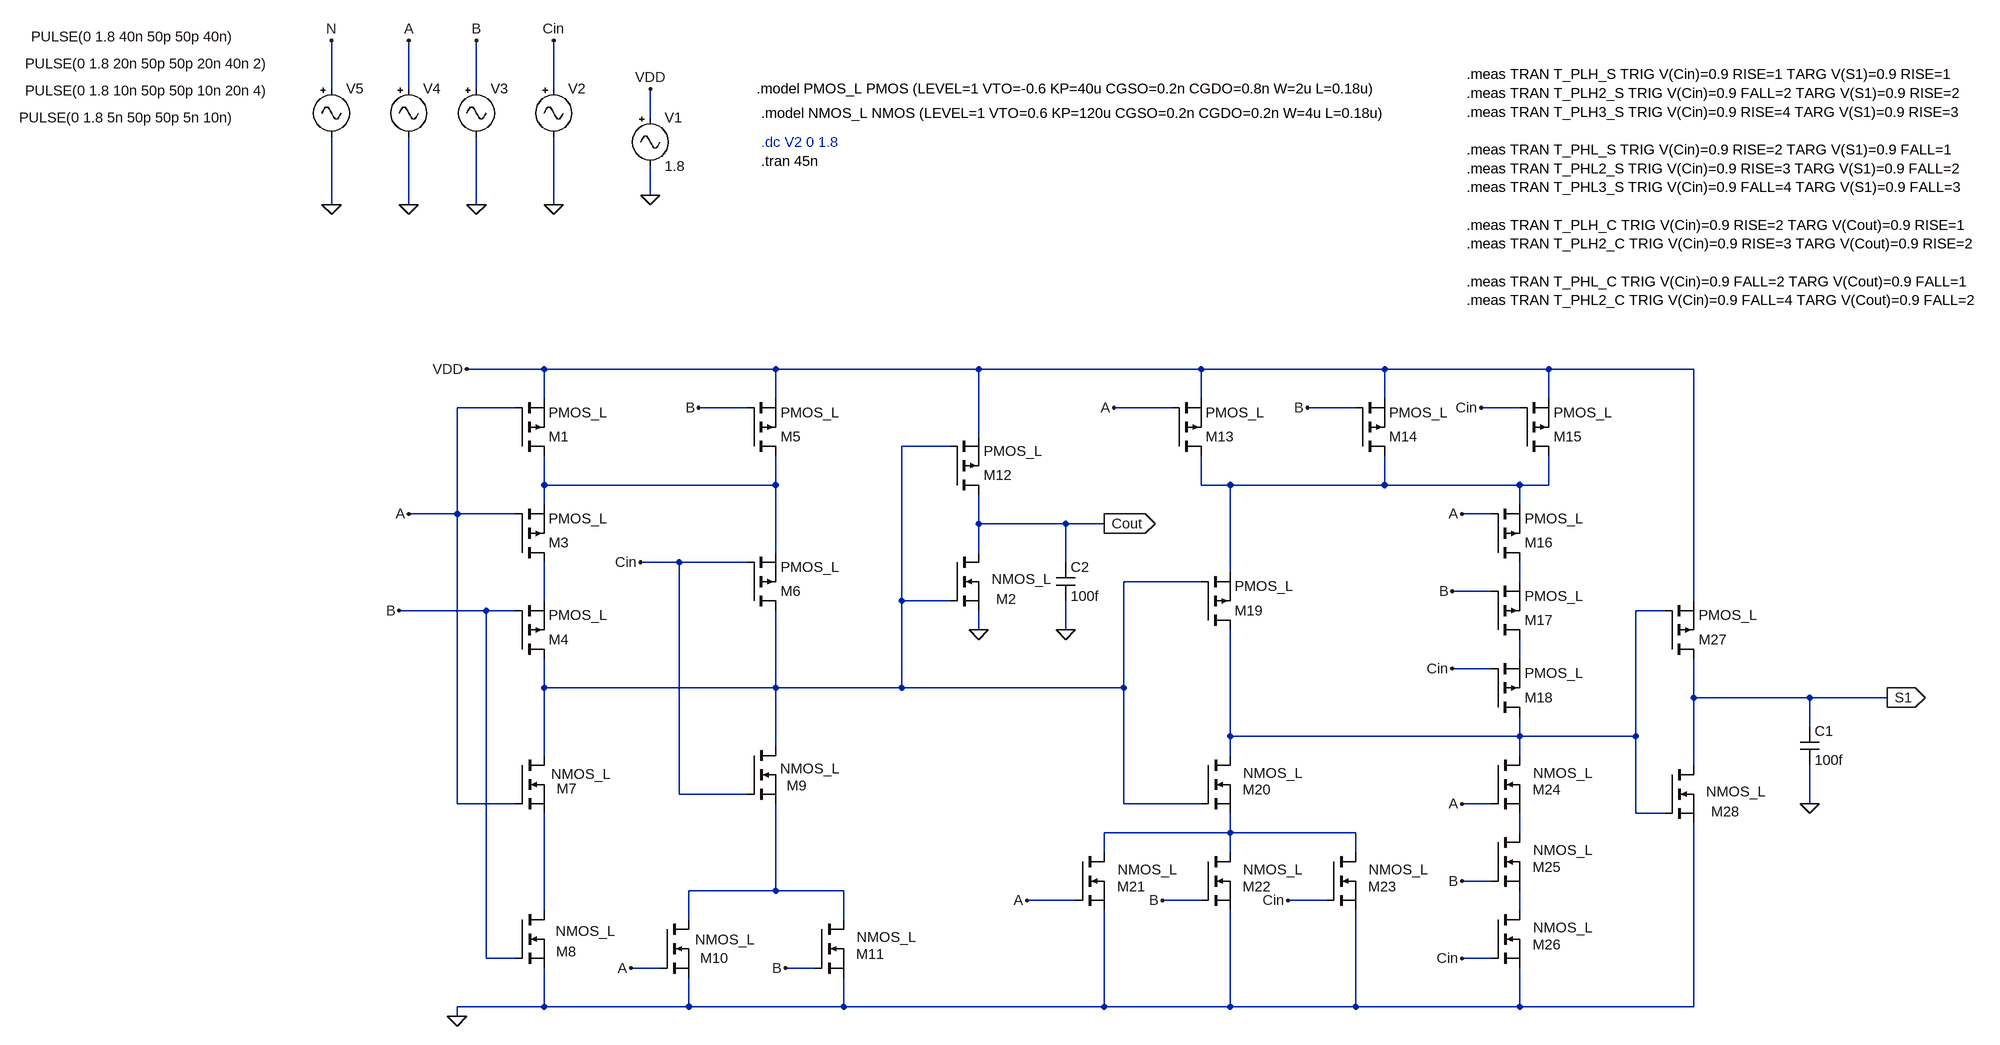
[diagram p0: schematic FullAdderT28.asc]
FullAdderT28.asc, the LTspice schematic file:
Version 4.1
SHEET 1 2296 1688
WIRE -480 80 -480 0
WIRE -352 80 -352 0
WIRE -240 80 -240 0
WIRE -112 80 -112 0
WIRE 48 128 48 80
WIRE 48 256 48 208
WIRE -480 272 -480 160
WIRE -352 272 -352 160
WIRE -240 272 -240 160
WIRE -112 272 -112 160
WIRE -128 544 -256 544
WIRE 256 544 -128 544
WIRE 592 544 256 544
WIRE 960 544 592 544
WIRE 1264 544 960 544
WIRE 1536 544 1264 544
WIRE 1776 544 1536 544
WIRE -128 592 -128 544
WIRE 256 592 256 544
WIRE 960 592 960 544
WIRE 1264 592 1264 544
WIRE 1536 592 1536 544
WIRE -176 608 -272 608
WIRE 208 608 128 608
WIRE 912 608 816 608
WIRE 1216 608 1136 608
WIRE 1488 608 1424 608
WIRE 592 656 592 544
WIRE 544 672 464 672
WIRE -128 736 -128 688
WIRE 256 736 256 688
WIRE 256 736 -128 736
WIRE 960 736 960 688
WIRE 1008 736 960 736
WIRE 1264 736 1264 688
WIRE 1264 736 1008 736
WIRE 1488 736 1264 736
WIRE 1536 736 1536 688
WIRE 1536 736 1488 736
WIRE -128 768 -128 736
WIRE 1488 768 1488 736
WIRE -272 784 -272 608
WIRE -272 784 -352 784
WIRE -176 784 -272 784
WIRE 1440 784 1392 784
WIRE 592 800 592 752
WIRE 736 800 592 800
WIRE 800 800 736 800
WIRE 256 848 256 736
WIRE 592 848 592 800
WIRE 96 864 32 864
WIRE 208 864 96 864
WIRE 736 864 736 800
WIRE 1008 880 1008 736
WIRE 960 896 832 896
WIRE 1488 896 1488 864
WIRE 1440 912 1376 912
WIRE -128 928 -128 864
WIRE 464 928 464 672
WIRE 544 928 464 928
WIRE 1776 928 1776 544
WIRE -224 944 -368 944
WIRE -176 944 -224 944
WIRE 1728 944 1680 944
WIRE 592 976 592 944
WIRE 736 976 736 928
WIRE 1488 1024 1488 992
WIRE 1440 1040 1376 1040
WIRE -128 1072 -128 1024
WIRE 256 1072 256 944
WIRE 256 1072 -128 1072
WIRE 464 1072 464 928
WIRE 464 1072 256 1072
WIRE 832 1072 832 896
WIRE 832 1072 464 1072
WIRE 1776 1088 1776 1024
WIRE 1968 1088 1776 1088
WIRE 2096 1088 1968 1088
WIRE 1968 1136 1968 1088
WIRE 1008 1152 1008 976
WIRE 1488 1152 1488 1120
WIRE 1488 1152 1008 1152
WIRE 1680 1152 1680 944
WIRE 1680 1152 1488 1152
WIRE 256 1168 256 1072
WIRE -128 1184 -128 1072
WIRE 1008 1184 1008 1152
WIRE 1488 1184 1488 1152
WIRE 1776 1200 1776 1088
WIRE 96 1248 96 864
WIRE 208 1248 96 1248
WIRE -272 1264 -272 784
WIRE -176 1264 -272 1264
WIRE 832 1264 832 1072
WIRE 960 1264 832 1264
WIRE 1440 1264 1392 1264
WIRE 1968 1264 1968 1200
WIRE 1680 1280 1680 1152
WIRE 1728 1280 1680 1280
WIRE 1008 1312 1008 1280
WIRE 1008 1312 800 1312
WIRE 1216 1312 1008 1312
WIRE 1488 1312 1488 1280
WIRE 800 1344 800 1312
WIRE 1008 1344 1008 1312
WIRE 1216 1344 1216 1312
WIRE 1440 1392 1392 1392
WIRE 256 1408 256 1264
WIRE 256 1408 112 1408
WIRE 368 1408 256 1408
WIRE 752 1424 672 1424
WIRE 960 1424 896 1424
WIRE 1168 1424 1104 1424
WIRE -128 1440 -128 1280
WIRE 1488 1440 1488 1408
WIRE 112 1456 112 1408
WIRE 368 1456 368 1408
WIRE -224 1520 -224 944
WIRE -176 1520 -224 1520
WIRE 1440 1520 1392 1520
WIRE 64 1536 16 1536
WIRE 320 1536 272 1536
WIRE -128 1600 -128 1536
WIRE -128 1600 -272 1600
WIRE 112 1600 112 1552
WIRE 112 1600 -128 1600
WIRE 368 1600 368 1552
WIRE 368 1600 112 1600
WIRE 800 1600 800 1440
WIRE 800 1600 368 1600
WIRE 1008 1600 1008 1440
WIRE 1008 1600 800 1600
WIRE 1216 1600 1216 1440
WIRE 1216 1600 1008 1600
WIRE 1488 1600 1488 1536
WIRE 1488 1600 1216 1600
WIRE 1776 1600 1776 1296
WIRE 1776 1600 1488 1600
WIRE -272 1616 -272 1600
FLAG 48 80 VDD
FLAG 48 256 0
FLAG -112 272 0
FLAG -112 0 Cin
FLAG -240 272 0
FLAG -240 0 B
FLAG -352 272 0
FLAG -352 0 A
FLAG -480 272 0
FLAG -480 0 N
FLAG -256 544 VDD
FLAG -272 1616 0
FLAG 592 976 0
FLAG -352 784 A
FLAG 16 1536 A
FLAG 1392 784 A
FLAG 1392 1264 A
FLAG 672 1424 A
FLAG 816 608 A
FLAG 128 608 B
FLAG 272 1536 B
FLAG -368 944 B
FLAG 896 1424 B
FLAG 1136 608 B
FLAG 1376 912 B
FLAG 1392 1392 B
FLAG 32 864 Cin
FLAG 1104 1424 Cin
FLAG 1424 608 Cin
FLAG 1376 1040 Cin
FLAG 1392 1520 Cin
FLAG 800 800 Cout
IOPIN 800 800 Out
FLAG 2096 1088 S1
IOPIN 2096 1088 Out
FLAG 1968 1264 0
FLAG 736 976 0
SYMBOL Misc\\signal 48 112 R0
WINDOW 123 0 0 Left 0
WINDOW 39 0 0 Left 0
SYMATTR InstName V1
SYMATTR Value 1.8
SYMBOL Misc\\signal -112 64 R0
WINDOW 3 -885 64 Left 2
WINDOW 123 0 0 Left 0
WINDOW 39 0 0 Left 0
SYMATTR Value PULSE(0 1.8 5n 50p 50p 5n 10n)
SYMATTR InstName V2
SYMBOL Misc\\signal -240 64 R0
WINDOW 3 -747 19 Left 2
WINDOW 123 0 0 Left 0
WINDOW 39 0 0 Left 0
SYMATTR Value PULSE(0 1.8 10n 50p 50p 10n 20n 4)
SYMATTR InstName V3
SYMBOL Misc\\signal -352 64 R0
WINDOW 3 -635 -26 Left 2
WINDOW 123 0 0 Left 0
WINDOW 39 0 0 Left 0
SYMATTR Value PULSE(0 1.8 20n 50p 50p 20n 40n 2)
SYMATTR InstName V4
SYMBOL Misc\\signal -480 64 R0
WINDOW 3 -497 -70 Left 2
WINDOW 123 0 0 Left 0
WINDOW 39 0 0 Left 0
SYMATTR Value PULSE(0 1.8 40n 50p 50p 40n)
SYMATTR InstName V5
SYMBOL pmos -176 688 M180
SYMATTR InstName M1
SYMATTR Value PMOS_L
SYMBOL nmos 544 848 R0
WINDOW 0 77 77 Left 2
WINDOW 3 69 44 Left 2
SYMATTR InstName M2
SYMATTR Value NMOS_L
SYMBOL pmos -176 864 M180
SYMATTR InstName M3
SYMATTR Value PMOS_L
SYMBOL pmos -176 1024 M180
SYMATTR InstName M4
SYMATTR Value PMOS_L
SYMBOL pmos 208 688 M180
SYMATTR InstName M5
SYMATTR Value PMOS_L
SYMBOL pmos 208 944 M180
SYMATTR InstName M6
SYMATTR Value PMOS_L
SYMBOL nmos -176 1184 R0
WINDOW 0 69 55 Left 2
WINDOW 3 60 31 Left 2
SYMATTR InstName M7
SYMATTR Value NMOS_L
SYMBOL nmos -176 1440 R0
WINDOW 0 68 69 Left 2
WINDOW 3 67 35 Left 2
SYMATTR InstName M8
SYMATTR Value NMOS_L
SYMBOL nmos 208 1168 R0
WINDOW 0 66 66 Left 2
WINDOW 3 55 38 Left 2
SYMATTR InstName M9
SYMATTR Value NMOS_L
SYMBOL nmos 64 1456 R0
WINDOW 0 67 64 Left 2
WINDOW 3 58 33 Left 2
SYMATTR InstName M10
SYMATTR Value NMOS_L
SYMBOL nmos 320 1456 R0
WINDOW 0 69 57 Left 2
WINDOW 3 70 29 Left 2
SYMATTR InstName M11
SYMATTR Value NMOS_L
SYMBOL pmos 544 752 M180
SYMATTR InstName M12
SYMATTR Value PMOS_L
SYMBOL pmos 912 688 M180
SYMATTR InstName M13
SYMATTR Value PMOS_L
SYMBOL pmos 1216 688 M180
SYMATTR InstName M14
SYMATTR Value PMOS_L
SYMBOL pmos 1488 688 M180
SYMATTR InstName M15
SYMATTR Value PMOS_L
SYMBOL pmos 1440 864 M180
SYMATTR InstName M16
SYMATTR Value PMOS_L
SYMBOL pmos 1440 992 M180
SYMATTR InstName M17
SYMATTR Value PMOS_L
SYMBOL pmos 1440 1120 M180
SYMATTR InstName M18
SYMATTR Value PMOS_L
SYMBOL pmos 960 976 M180
SYMATTR InstName M19
SYMATTR Value PMOS_L
SYMBOL nmos 960 1184 R0
WINDOW 0 69 57 Left 2
WINDOW 3 70 29 Left 2
SYMATTR InstName M20
SYMATTR Value NMOS_L
SYMBOL nmos 752 1344 R0
WINDOW 0 69 57 Left 2
WINDOW 3 70 29 Left 2
SYMATTR InstName M21
SYMATTR Value NMOS_L
SYMBOL nmos 960 1344 R0
WINDOW 0 69 57 Left 2
WINDOW 3 70 29 Left 2
SYMATTR InstName M22
SYMATTR Value NMOS_L
SYMBOL nmos 1168 1344 R0
WINDOW 0 69 57 Left 2
WINDOW 3 70 29 Left 2
SYMATTR InstName M23
SYMATTR Value NMOS_L
SYMBOL nmos 1440 1184 R0
WINDOW 0 69 57 Left 2
WINDOW 3 70 29 Left 2
SYMATTR InstName M24
SYMATTR Value NMOS_L
SYMBOL nmos 1440 1312 R0
WINDOW 0 69 57 Left 2
WINDOW 3 70 29 Left 2
SYMATTR InstName M25
SYMATTR Value NMOS_L
SYMBOL nmos 1440 1440 R0
WINDOW 0 69 57 Left 2
WINDOW 3 70 29 Left 2
SYMATTR InstName M26
SYMATTR Value NMOS_L
SYMBOL pmos 1728 1024 M180
SYMATTR InstName M27
SYMATTR Value PMOS_L
SYMBOL nmos 1728 1200 R0
WINDOW 0 77 77 Left 2
WINDOW 3 69 44 Left 2
SYMATTR InstName M28
SYMATTR Value NMOS_L
SYMBOL cap 1952 1136 R0
SYMATTR InstName C1
SYMATTR Value 100f
SYMBOL cap 720 864 R0
SYMATTR InstName C2
SYMATTR Value 100f
TEXT 232 200 Left 2 !.tran 45n
TEXT 224 80 Left 2 !.model PMOS_L PMOS (LEVEL=1 VTO=-0.6 KP=40u CGSO=0.2n CGDO=0.8n W=2u L=0.18u)
TEXT 232 120 Left 2 !.model NMOS_L NMOS (LEVEL=1 VTO=0.6 KP=120u CGSO=0.2n CGDO=0.2n W=4u L=0.18u)
TEXT 232 168 Left 2 ;.dc V2 0 1.8
TEXT 1400 56 Left 2 !.meas TRAN T_PLH_S TRIG V(Cin)=0.9 RISE=1 TARG V(S1)=0.9 RISE=1\n.meas TRAN T_PLH2_S TRIG V(Cin)=0.9 FALL=2 TARG V(S1)=0.9 RISE=2\n.meas TRAN T_PLH3_S TRIG V(Cin)=0.9 RISE=4 TARG V(S1)=0.9 RISE=3\n \n.meas TRAN T_PHL_S TRIG V(Cin)=0.9 RISE=2 TARG V(S1)=0.9 FALL=1\n.meas TRAN T_PHL2_S TRIG V(Cin)=0.9 RISE=3 TARG V(S1)=0.9 FALL=2  \n.meas TRAN T_PHL3_S TRIG V(Cin)=0.9 FALL=4 TARG V(S1)=0.9 FALL=3    \n \n.meas TRAN T_PLH_C TRIG V(Cin)=0.9 RISE=2 TARG V(Cout)=0.9 RISE=1\n.meas TRAN T_PLH2_C TRIG V(Cin)=0.9 RISE=3 TARG V(Cout)=0.9 RISE=2\n \n.meas TRAN T_PHL_C TRIG V(Cin)=0.9 FALL=2 TARG V(Cout)=0.9 FALL=1\n.meas TRAN T_PHL2_C TRIG V(Cin)=0.9 FALL=4 TARG V(Cout)=0.9 FALL=2

The netlist it stands for:
* FullAdderT28.asc
V1 VDD 0 1.8
V2 Cin 0 PULSE(0 1.8 5n 50p 50p 5n 10n)
V3 B 0 PULSE(0 1.8 10n 50p 50p 10n 20n 4)
V4 A 0 PULSE(0 1.8 20n 50p 50p 20n 40n 2)
V5 N 0 PULSE(0 1.8 40n 50p 50p 40n)
M1 N002 A VDD VDD PMOS_L
M2 Cout N001 0 0 NMOS_L
M3 N005 A N002 N002 PMOS_L
M4 N001 B N005 N005 PMOS_L
M5 N002 B VDD VDD PMOS_L
M6 N001 Cin N002 N002 PMOS_L
M7 N001 A N011 N011 NMOS_L
M8 N011 B 0 0 NMOS_L
M9 N001 Cin N010 N010 NMOS_L
M10 N010 A 0 0 NMOS_L
M11 N010 B 0 0 NMOS_L
M12 Cout N001 VDD VDD PMOS_L
M13 N003 A VDD VDD PMOS_L
M14 N003 B VDD VDD PMOS_L
M15 N003 Cin VDD VDD PMOS_L
M16 N004 A N003 N003 PMOS_L
M17 N007 B N004 N004 PMOS_L
M18 N006 Cin N007 N007 PMOS_L
M19 N006 N001 N003 N003 PMOS_L
M20 N006 N001 N008 N008 NMOS_L
M21 N008 A 0 0 NMOS_L
M22 N008 B 0 0 NMOS_L
M23 N008 Cin 0 0 NMOS_L
M24 N006 A N009 N009 NMOS_L
M25 N009 B N012 N012 NMOS_L
M26 N012 Cin 0 0 NMOS_L
M27 S1 N006 VDD VDD PMOS_L
M28 S1 N006 0 0 NMOS_L
C1 S1 0 100f
C2 Cout 0 100f
.model NMOS NMOS
.model PMOS PMOS
.lib standard.mos
.tran 45n
.model PMOS_L PMOS (LEVEL=1 VTO=-0.6 KP=40u CGSO=0.2n CGDO=0.8n W=2u L=0.18u)
.model NMOS_L NMOS (LEVEL=1 VTO=0.6 KP=120u CGSO=0.2n CGDO=0.2n W=4u L=0.18u)
* .dc V2 0 1.8
.meas TRAN T_PLH_S TRIG V(Cin)=0.9 RISE=1 TARG V(S1)=0.9 RISE=1
.meas TRAN T_PLH2_S TRIG V(Cin)=0.9 FALL=2 TARG V(S1)=0.9 RISE=2
.meas TRAN T_PLH3_S TRIG V(Cin)=0.9 RISE=4 TARG V(S1)=0.9 RISE=3
.meas TRAN T_PHL_S TRIG V(Cin)=0.9 RISE=2 TARG V(S1)=0.9 FALL=1
.meas TRAN T_PHL2_S TRIG V(Cin)=0.9 RISE=3 TARG V(S1)=0.9 FALL=2
.meas TRAN T_PHL3_S TRIG V(Cin)=0.9 FALL=4 TARG V(S1)=0.9 FALL=3
.meas TRAN T_PLH_C TRIG V(Cin)=0.9 RISE=2 TARG V(Cout)=0.9 RISE=1
.meas TRAN T_PLH2_C TRIG V(Cin)=0.9 RISE=3 TARG V(Cout)=0.9 RISE=2
.meas TRAN T_PHL_C TRIG V(Cin)=0.9 FALL=2 TARG V(Cout)=0.9 FALL=1
.meas TRAN T_PHL2_C TRIG V(Cin)=0.9 FALL=4 TARG V(Cout)=0.9 FALL=2
.backanno
.end